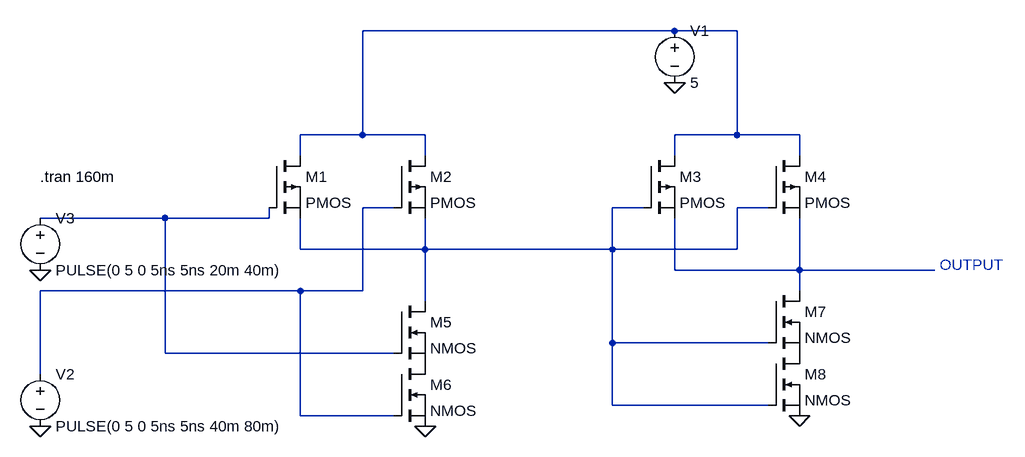
[diagram p0: schematic and-gate-ltspice.asc]
and-gate-ltspice.asc, the LTspice schematic file:
Version 4
SHEET 1 1412 1360
WIRE 896 -352 416 -352
WIRE 992 -352 896 -352
WIRE 416 -192 416 -352
WIRE 416 -192 320 -192
WIRE 512 -192 416 -192
WIRE 992 -192 992 -352
WIRE 992 -192 896 -192
WIRE 1088 -192 992 -192
WIRE 320 -160 320 -192
WIRE 512 -160 512 -192
WIRE 896 -160 896 -192
WIRE 1088 -160 1088 -192
WIRE 464 -80 416 -80
WIRE 848 -80 800 -80
WIRE 1040 -80 992 -80
WIRE 112 -64 -80 -64
WIRE 272 -64 272 -80
WIRE 272 -64 112 -64
WIRE 320 -16 320 -64
WIRE 512 -16 512 -64
WIRE 512 -16 320 -16
WIRE 800 -16 800 -80
WIRE 800 -16 512 -16
WIRE 992 -16 992 -80
WIRE 992 -16 800 -16
WIRE 896 16 896 -64
WIRE 1088 16 1088 -64
WIRE 1088 16 896 16
WIRE 1296 16 1088 16
WIRE 320 48 -80 48
WIRE 416 48 416 -80
WIRE 416 48 320 48
WIRE 1088 48 1088 16
WIRE 512 64 512 -16
WIRE 800 128 800 -16
WIRE 1040 128 800 128
WIRE 112 144 112 -64
WIRE 464 144 112 144
WIRE -80 176 -80 48
WIRE 800 224 800 128
WIRE 1040 224 800 224
WIRE 320 240 320 48
WIRE 464 240 320 240
FLAG 1088 240 0
FLAG 512 256 0
FLAG 896 -272 0
FLAG -80 256 0
FLAG -80 16 0
SYMBOL pmos 272 -160 R0
SYMATTR InstName M1
SYMBOL pmos 464 -160 R0
SYMATTR InstName M2
SYMBOL pmos 848 -160 R0
SYMATTR InstName M3
SYMBOL pmos 1040 -160 R0
SYMATTR InstName M4
SYMBOL nmos 464 64 R0
SYMATTR InstName M5
SYMBOL nmos 464 160 R0
SYMATTR InstName M6
SYMBOL nmos 1040 48 R0
SYMATTR InstName M7
SYMBOL nmos 1040 144 R0
SYMATTR InstName M8
SYMBOL voltage 896 -368 R0
SYMATTR InstName V1
SYMATTR Value 5
SYMBOL voltage -80 160 R0
SYMATTR InstName V2
SYMATTR Value PULSE(0 5 0 5ns 5ns 40m 80m)
SYMBOL voltage -80 -80 R0
SYMATTR InstName V3
SYMATTR Value PULSE(0 5 0 5ns 5ns 20m 40m)
TEXT -80 -128 Left 2 !.tran 160m
TEXT 1304 8 Left 2 ;OUTPUT

The netlist it stands for:
* and-gate-ltspice.asc
M1 N001 N004 N003 N003 PMOS
M2 N001 N002 N003 N003 PMOS
M3 N001 N003 N005 N005 PMOS
M4 N001 N003 N005 N005 PMOS
M5 N003 N004 P001 P001 NMOS
M6 P001 N002 0 0 NMOS
M7 N005 N003 P002 P002 NMOS
M8 P002 N003 0 0 NMOS
V1 N001 0 5
V2 N002 0 PULSE(0 5 0 5ns 5ns 40m 80m)
V3 N004 0 PULSE(0 5 0 5ns 5ns 20m 40m)
.model NMOS NMOS
.model PMOS PMOS
.lib standard.mos
.tran 160m
* OUTPUT
.backanno
.end